# EAGLE schematic PD_Controller (EAGLE 9.6.2)
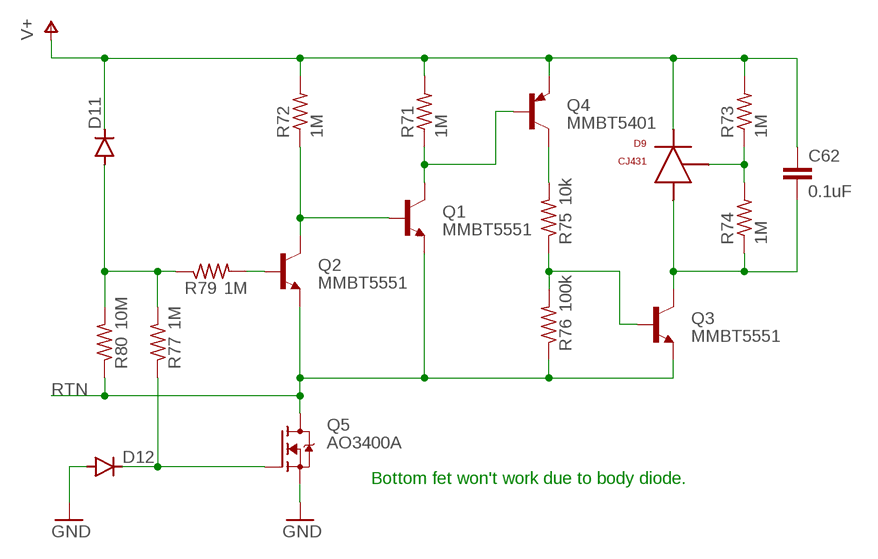
[diagram p0: schematic, sheet 1]

## Parts
C62  0.1uF  0402_CAPACITOR  [0402_INDUCTOR]
D9  CJ431  [SOT23-3_CENTERED]
D11  DIODE-MINIMELF  [MINIMELF]
D12  DIODE-MINIMELF  [MINIMELF]
Q1  MMBT5551  MMBT3904-TPCENTERED  [SOT23-3_CENTERED]
Q2  MMBT5551  MMBT3904-TPCENTERED  [SOT23-3_CENTERED]
Q3  MMBT5551  MMBT3904-TPCENTERED  [SOT23-3_CENTERED]
Q4  MMBT5401  MMBT3906-7-FCENTERED  [SOT23-3_CENTERED]
Q5  AO3400A  [SOT23-3_CENTERED]
R71  1M  0603_RESISTOR  [0603]
R72  1M  0603_RESISTOR  [0603]
R73  1M  0603_RESISTOR  [0603]
R74  1M  0603_RESISTOR  [0603]
R75  10k  0402_RESISTOR  [R0402]
R76  100k  0402_RESISTOR  [R0402]
R77  1M  0402_RESISTOR  [R0402]
R79  1M  0402_RESISTOR  [R0402]
R80  10M  0402_RESISTOR  [R0402]

## Nets
GND: D12.A Q5.2(S)
N$7: C62.P$2 D9.3(A) Q3.3(C) R74.1
N$11: Q4.3(C) R75.2
N$20: D9.1(REF) R73.1 R74.2
N$28: Q3.1(B) R75.1 R76.2
N$35: Q1.3(C) Q4.1(B) R71.1
N$39: Q1.1(B) Q2.3(C) R72.1
N$41: D11.A R77.2 R79.1 R80.2
N$44: Q2.1(B) R79.2
N$45: D12.C Q5.1(G) R77.1
RTN: Q1.2(E) Q2.2(E) Q3.2(E) Q5.3(D) R76.1 R80.1
V+ [HV]: C62.P$1 D9.2(K) D11.C Q4.2(E) R71.2 R72.2 R73.2

## Notes on the sheet
- Bottom fet won't work due to body diode.

## Library data of the parts
C62 = ruark2:0402_CAPACITOR: 0402 select capacitor; VALUE: sel
D9 = ruark2:CJ431: 2.5V~36V -25℃~+85℃@(TA) ±0.5% 1mA 100mA 50ppm/℃ Adjustable SOT-23(SOT-23-3) Voltage References ROHS
D11 D12 = diode:DIODE-: DIODE
Q1-Q3 = ruark2:MMBT3904-TP: Bipolar (BJT) Transistor NPN 40V 200mA 300MHz 350mW Surface Mount SOT-23 (SMD 2N3904)
Q4 = ruark2:MMBT3906-7-F: Bipolar (BJT) Transistor PNP 40V 200mA 250MHz 300mW Surface Mount SOT-23-3 (SMD 2N3906)
Q5 = ruark2:AO3400A: N-Channel 5.7A (Ta) 1.4W (Ta) Surface Mount SOT-23-3L
R71-R74 = ruark2:0603_RESISTOR: 0603 Resistor -- WARNING: NO DEFINED PART NUMBER OR VALUE; VALUE: sel
R75-R77 R79 R80 = ruark2:0402_RESISTOR: 0402 Resistor -- WARNING: NO DEFINED PART NUMBER OR VALUE

## Net classes
1 HV: clearance 0.406 mm